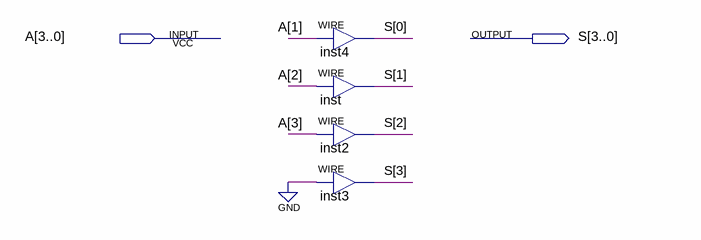
[diagram p0: schematic sheet]
// Quartus schematic half.bdf as structural Verilog: 4 symbols, 2 pins
module half (
  input  [3:0] A,
  output [3:0] S
);

  assign S[0] = A[1];  // WIRE inst4
  assign S[1] = A[2];  // WIRE inst
  assign S[2] = A[3];  // WIRE inst2
  assign S[3] = 1'b0;  // WIRE inst3
endmodule
